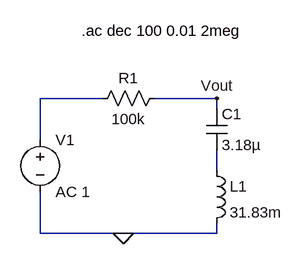
[diagram p0: schematic circuito_2.asc]
circuito_2.asc, the LTspice schematic file:
Version 4.1
SHEET 1 880 680
WIRE 112 48 16 48
WIRE 288 48 192 48
WIRE 288 64 288 48
WIRE 16 112 16 48
WIRE 288 160 288 128
WIRE 16 256 16 192
WIRE 144 256 16 256
WIRE 288 256 288 240
WIRE 288 256 144 256
FLAG 144 256 0
FLAG 288 48 Vout
SYMBOL voltage 16 96 R0
SYMATTR InstName V1
SYMATTR Value AC 1
SYMBOL res 208 32 R90
WINDOW 0 0 56 VBottom 2
WINDOW 3 32 56 VTop 2
SYMATTR InstName R1
SYMATTR Value 100k
SYMBOL cap 272 64 R0
SYMATTR InstName C1
SYMATTR Value 3.18µ
SYMBOL ind 272 144 R0
SYMATTR InstName L1
SYMATTR Value 31.83m
TEXT 80 -56 Left 2 !.ac dec 100 0.01 2meg

The netlist it stands for:
* circuito_2.asc
V1 N001 0 AC 1
R1 Vout N001 100k
C1 Vout N002 3.18µ
L1 N002 0 31.83m
.ac dec 100 0.01 2meg
.backanno
.end